# Altium schematic sheet coverpage.SchDoc: Cover
size A4; Organization: GPA Robotics; DocumentNumber: 1; SheetNumber: 1; SheetTotal: 11
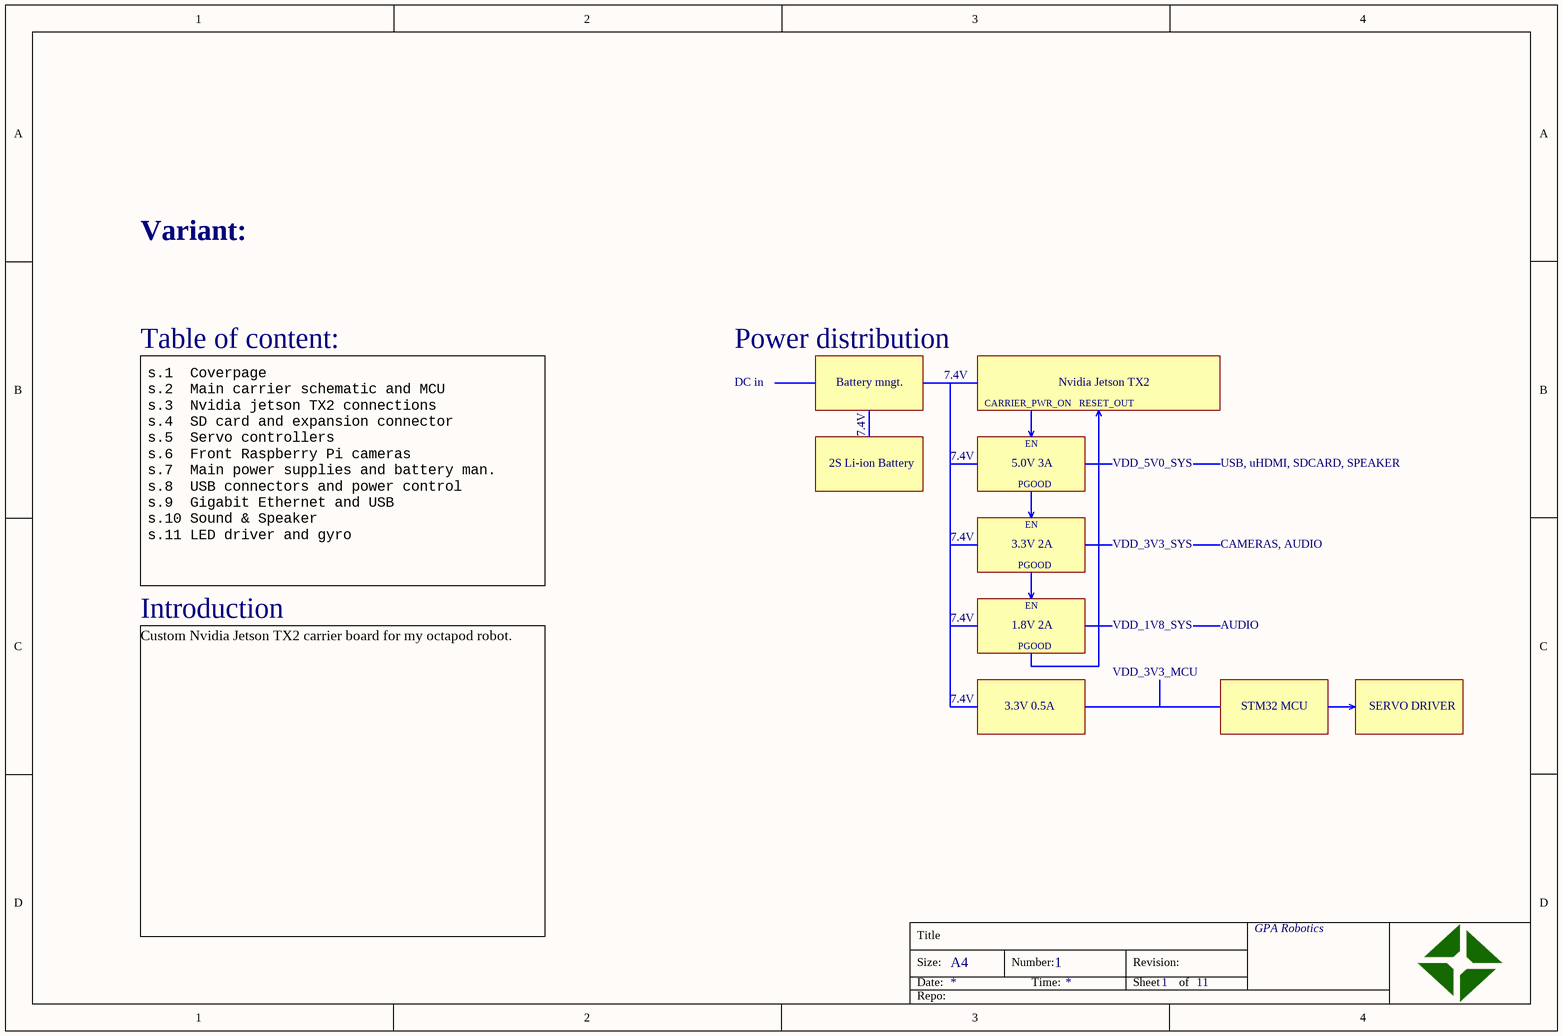
[diagram p0: coverpage.SchDoc]

## Notes on the sheet
- Table of content:
- DC in
- Power distribution
- Battery mngt.
- 7.4V
- Nvidia Jetson TX2
- CARRIER_PWR_ON
- EN
- RESET_OUT
- 2S Li-ion Battery
- 5.0V 3A
- PGOOD
- VDD_5V0_SYS
- USB, uHDMI, SDCARD, SPEAKER
- s.1  Coverpage
  s.2  Main carrier schematic and MCU
  s.3  Nvidia jetson TX2 connections
  s.4  SD card and expansion connector
  s.5  Servo controllers
  s.6  Front Raspberry Pi cameras
  s.7  Main power supplies and battery man.
  s.8  USB connectors and power control
  s.9  Gigabit Ethernet and USB
  s.10 Sound & Speaker
  s.11 LED driver and gyro
- 3.3V 2A
- VDD_3V3_SYS
- CAMERAS, AUDIO
- Introduction
- 1.8V 2A
- VDD_1V8_SYS
- AUDIO
- 3.3V 0.5A
- VDD_3V3_MCU
- STM32 MCU
- SERVO DRIVER
- Custom Nvidia Jetson TX2 carrier board for my octapod robot.
- Variant:
- Title
- Size:
- Date:
- A4
- Number:
- Time:
- Revision:
- Sheet
- of
- Repo: